# Altium schematic sheet Impedance converter.SchDoc
size A4; CompanyName: Technische Hochschule Nürnberg Georg Simon Ohm; DrawnBy: Bauer Martin; Engineer: Bauer Martin; Organization: UltraZohm; Address1: Kesslerplatz 12; Address2: 90489 Nürnberg; Address3: GERMANY; DocumentNumber: 5; SheetNumber: 5; SheetTotal: 6; Website: www.ultrazohm.com
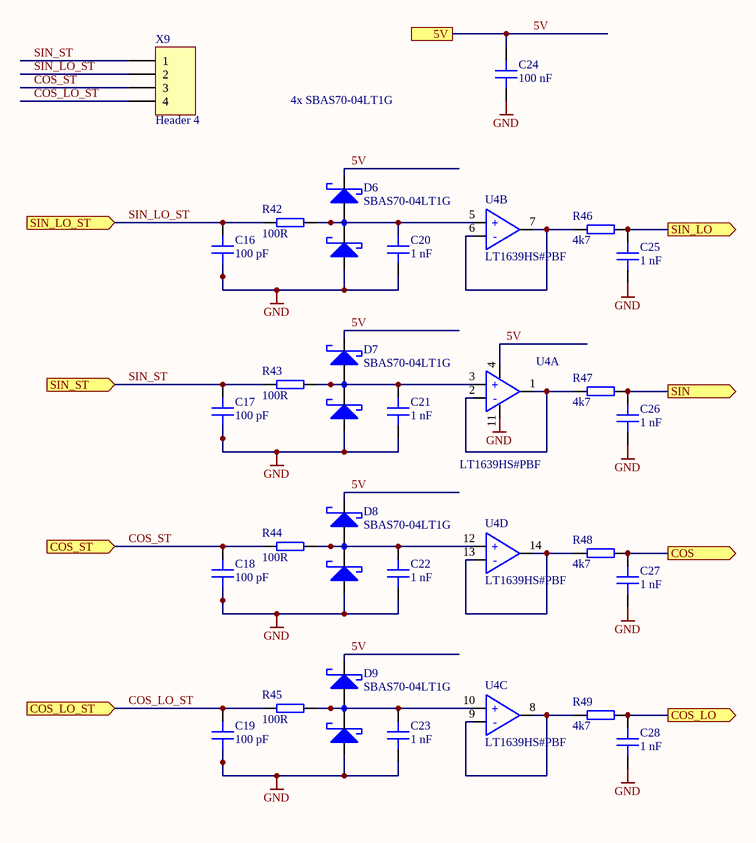
[diagram p0: Impedance converter.SchDoc]

## Parts
C16  100 pF  [C_0603]
C17  100 pF  [C_0603]
C18  100 pF  [C_0603]
C19  100 pF  [C_0603]
C20  1 nF  [C_0603]
C21  1 nF  [C_0603]
C22  1 nF  [C_0603]
C23  1 nF  [C_0603]
C24  100 nF  [C_0603]
C25  1 nF  [C_0603]
C26  1 nF  [C_0603]
C27  1 nF  [C_0603]
C28  1 nF  [C_0603]
D6  SBAS70-04LT1G  [SOT-23]
D7  SBAS70-04LT1G  [SOT-23]
D8  SBAS70-04LT1G  [SOT-23]
D9  SBAS70-04LT1G  [SOT-23]
R42  100R  [RES 0603_1608]
R43  100R  [RES 0603_1608]
R44  100R  [RES 0603_1608]
R45  100R  [RES 0603_1608]
R46  4k7  [RES 0603_1608]
R47  4k7  [RES 0603_1608]
R48  4k7  [RES 0603_1608]
R49  4k7  [RES 0603_1608]
U4  LT1639HS#PBF  [SOIC-14]  (parts A,B,C,D of 4)
X9  Header 4  [HDR1X4]

## Ports
5V, COS (out), COS_LO (out), COS_LO_ST (in), COS_ST (in), SIN (out), SIN_LO (out), SIN_LO_ST (in), SIN_ST (in)

## Nets
GND: C16.2 C17.2 C18.2 C19.2 C20.2 C21.2 C22.2 C23.2 C24.2 C25.2 C26.2 C27.2 C28.2 D6.1 D7.1 D8.1 D9.1 U4.11(V-)
5V: C24.1 D6.2 D7.2 D8.2 D9.2 U4.4(V+) ; port 5V
COS: C27.1 R48.2 ; port COS
COS_LO: C28.1 R49.2 ; port COS_LO
COS_LO_ST: C19.1 R45.1 X9.4 ; port COS_LO_ST
COS_ST: C18.1 R44.1 X9.3 ; port COS_ST
SIN: C26.1 R47.2 ; port SIN
SIN_LO: C25.1 R46.2 ; port SIN_LO
SIN_LO_ST: C16.1 R42.1 X9.2 ; port SIN_LO_ST
SIN_ST: C17.1 R43.1 X9.1 ; port SIN_ST
NetC20_1: C20.1 D6.3 R42.2 U4.5(+)
NetC21_1: C21.1 D7.3 R43.2 U4.3(+)
NetC22_1: C22.1 D8.3 R44.2 U4.12(+)
NetC23_1: C23.1 D9.3 R45.2 U4.10(+)
NetR46_1: R46.1 U4.6(-) U4.7
NetR47_1: R47.1 U4.1 U4.2(-)
NetR48_1: R48.1 U4.13(-) U4.14
NetR49_1: R49.1 U4.8 U4.9(-)

## Notes on the sheet
- 4x SBAS70-04LT1G
- Title
- Revision:
- Design Engineer:
- Date:
- Project:
- Sheet
- of

## Library data of the parts
C16-C19 = CL10C101JB8NNNC: 50V 100pF C0G ±5% 0603 Multilayer Ceramic Capacitors MLCC - SMD/SMT ROHS; Manufacturer: Samsung Electro-Mechanics; Voltage Rating: 50 VDC; Created from: AGeiger; Value: 100 pF; Supplier 1: LCSC; Supplier Part Number 1: C14858; Manufacturer Part Number: CL10C101JB8NNNC; PartID: 106; Created On: 03.09.2022 10:55:28; ComponentLink1Description: Datasheet; ComponentLink1URL: https://datasheet.lcsc.com/lcsc/1811151136_Samsung-Electro-Mechanics-CL10C101JB8NNNC_C14858.pdf; Component Type: Capacitor 0603; Device Package: 0603; Last Updated: 03.09.2022 10:55:28; Mounting Type: SMD; Operating Temperature: -55 - 125°C; Series: C0G; Type: Capacitor; Tolerance: 5 %; Live Cycle Status: 1; LCSC Part Number: C14858
C20-C23 C25-C28 = CC0603JRNPO9BN102: Capacitor 0603, 50 VDC, 1 nF, NP0; Manufacturer: YAGEO; Tolerance: 5 %; Voltage Rating: 50 VDC; Created from: AGeiger; Value: 1 nF; Supplier 1: LCSC; Supplier Part Number 1: C106246; Manufacturer Part Number: CC0603JRNPO9BN102; PartID: 104; Created On: 30.08.2022 11:46:28; ComponentLink1Description: Datasheet; ComponentLink1URL: https://datasheet.lcsc.com/lcsc/1811021411_YAGEO-CC0603JRNPO9BN102_C106246.pdf; Component Type: Capacitor 0603; Device Package: 0603; Last Updated: 30.08.2022 11:46:28; Mounting Type: SMD; Operating Temperature: -55 - 125°C; Series: NP0; Type: Capacitor; Live Cycle Status: 1; LCSC Part Number: C106246
C24 = CC0603KRX7R9BB104: Capacitor 0603, 50 VDC, 100 nF, X7R; Manufacturer: YAGEO; Tolerance: 10 %; Voltage Rating: 50 VDC; Created from: AGeiger; Value: 100 nF; Supplier 1: LCSC; Supplier 2: Mouser; Supplier Part Number 1: C14663; Supplier Part Number 2: 603-CC603KRX7R9BB104; Manufacturer Part Number: CC0603KRX7R9BB104; PartID: 102; Created On: 22.08.2022 14:35:53; ComponentLink1Description: Datasheet; ComponentLink1URL: https://datasheet.lcsc.com/lcsc/1809301912_YAGEO-CC0603KRX7R9BB104_C14663.pdf; Component Type: Capacitor 0603; Device Package: 0603; Last Updated: 22.08.2022 14:35:53; Mounting Type: SMD; Operating Temperature: -55 - 125°C; Series: X7R; Type: Capacitor; Live Cycle Status: 1; LCSC Part Number: C14663
D6-D9 = Diode Array Schottky: DIODE SCHOTTKY 70V DUAL SOT23; MF: ON Semiconductor; Supplier Part Number 2: SBAS70-04LT1GOSCT-ND; MPN: SBAS70-04LT1G; Supplier Part Number 1: 863-SBAS70-04LT1G; Package: SOT-23-3; Supplier 1: Mouser; Supplier 2: Digi-Key; LCSC Part Number: C389351
R42-R45 = RK73B1JTTD101J: SMD resistor E24 series; Manufacturer: KOA Speer; Tolerance: 5%; Created from: MGremer; Value: 100R; Supplier 1: Mouser; Supplier Part Number 1: 660-RK73B1JTTD101J; Manufacturer Part Number: RK73B1JTTD101J; PartID: 50; Created On: 14.12.2020 16:17:14; ComponentLink1Description: Datasheet; ComponentLink1URL: https://www.mouser.de/datasheet/2/219/RK73B-1825463.pdf; Component Type: SMD resistor; Device Package: 0603; Last Updated: 29.11.2022 14:30:07; Mounting Type: SMD; Supplier 2: LCSC; Supplier Part Number 2: C22775; Type: Resistor; Live Cycle Status: 1; Stock number: Labor SMD Container; LCSC Part Number: C22775
R46-R49 = 0603WAF4701T5E: SMD resistor E24 series; Manufacturer: UNI-ROYAL; Tolerance: 1%; Created from: AGeiger; Value: 4k7; Supplier 1: LCSC; Supplier Part Number 1: C23162; Manufacturer Part Number: 0603WAF4701T5E; PartID: 90; Created On: 14.12.2020 16:17:14; ComponentLink1Description: Datasheet; ComponentLink1URL: https://datasheet.lcsc.com/lcsc/2206010116_UNI-ROYAL-Uniroyal-Elec-0603WAF4701T5E_C23162.pdf; Component Type: SMD resistor; Device Package: 0603; Last Updated: 25.08.2022 20:03:04; Mounting Type: SMD; Type: Resistor; Live Cycle Status: 1; Stock number: Labor SMD Container; LCSC Part Number: C23162
U4 = LT1639CS: IC OPAMP GP 4 CIRCUIT 14SO; MPN: LT1639CS#PBF; MF: Analog Devices; Supplier Part Number 2: LT1639CS#PBF-ND; Supplier Part Number 1: 584-LT1639CS#PBF; Package: SO-14; Supplier 1: Mouser; Supplier 2: Digikey; LCSC Part Number: C579803
X9 = Header 4: Header, 4-Pin; LatestRevisionDate: 17-Jul-2002; LatestRevisionNote: Re-released for DXP Platform.; Publisher: Altium Limited